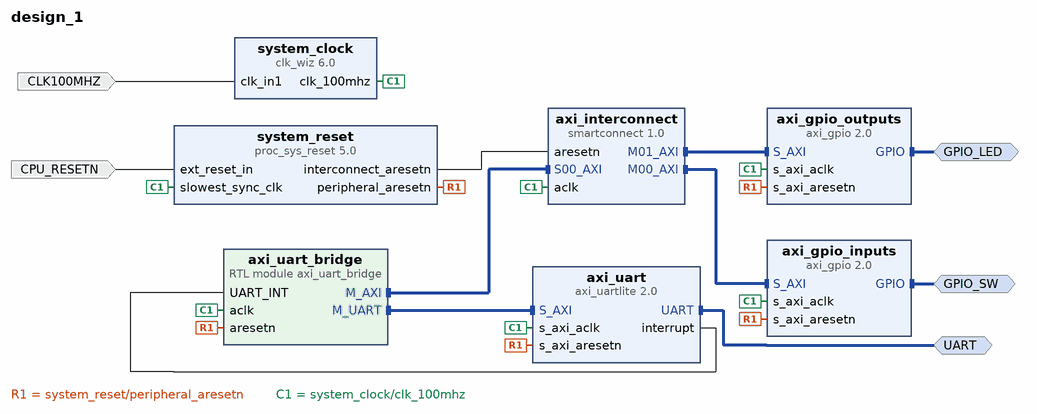
[diagram p0: block diagram of the top level]
# Vivado block design design_1, xc7a100tcsg324-1, Vivado 2021.1
create_bd_design design_1

create_bd_intf_port -mode Master -vlnv xilinx.com:interface:gpio_rtl:1.0 GPIO_LED
create_bd_intf_port -mode Master -vlnv xilinx.com:interface:gpio_rtl:1.0 GPIO_SW
create_bd_intf_port -mode Master -vlnv xilinx.com:interface:uart_rtl:1.0 UART
create_bd_port -dir I -type clk CLK100MHZ
set_property -dict {CONFIG.ASSOCIATED_RESET CPU_RESETN} [get_bd_ports CLK100MHZ]
create_bd_port -dir I -type rst CPU_RESETN

create_bd_cell -type ip -vlnv xilinx.com:ip:clk_wiz:6.0 system_clock
set_property -dict [list \
  CONFIG.CLKOUT1_DRIVES BUFGCE \
  CONFIG.CLKOUT2_DRIVES BUFGCE \
  CONFIG.CLKOUT3_DRIVES BUFGCE \
  CONFIG.CLKOUT4_DRIVES BUFGCE \
  CONFIG.CLKOUT5_DRIVES BUFGCE \
  CONFIG.CLKOUT6_DRIVES BUFGCE \
  CONFIG.CLKOUT7_DRIVES BUFGCE \
  CONFIG.CLK_OUT1_PORT clk_100mhz \
  CONFIG.FEEDBACK_SOURCE FDBK_AUTO \
  CONFIG.USE_LOCKED false \
  CONFIG.USE_RESET false \
  CONFIG.USE_SAFE_CLOCK_STARTUP true \
] [get_bd_cells system_clock]
create_bd_cell -type ip -vlnv xilinx.com:ip:proc_sys_reset:5.0 system_reset
set_property -dict {CONFIG.RESET_BOARD_INTERFACE reset CONFIG.USE_BOARD_FLOW true} [get_bd_cells system_reset]
create_bd_cell -type ip -vlnv xilinx.com:ip:smartconnect:1.0 axi_interconnect
set_property -dict {CONFIG.NUM_MI 2 CONFIG.NUM_SI 1} [get_bd_cells axi_interconnect]
create_bd_cell -type ip -vlnv xilinx.com:ip:axi_uartlite:2.0 axi_uart
set_property -dict [list \
  CONFIG.C_BAUDRATE 115200 \
  CONFIG.UARTLITE_BOARD_INTERFACE Custom \
  CONFIG.USE_BOARD_FLOW true \
] [get_bd_cells axi_uart]
create_bd_cell -type ip -vlnv xilinx.com:ip:axi_gpio:2.0 axi_gpio_inputs
set_property -dict [list \
  CONFIG.C_GPIO_WIDTH 4 \
  CONFIG.GPIO_BOARD_INTERFACE Custom \
  CONFIG.USE_BOARD_FLOW true \
] [get_bd_cells axi_gpio_inputs]
create_bd_cell -type ip -vlnv xilinx.com:ip:axi_gpio:2.0 axi_gpio_outputs
set_property -dict [list \
  CONFIG.C_ALL_INPUTS 0 \
  CONFIG.C_ALL_OUTPUTS 1 \
  CONFIG.C_GPIO_WIDTH 4 \
  CONFIG.GPIO_BOARD_INTERFACE Custom \
  CONFIG.USE_BOARD_FLOW true \
] [get_bd_cells axi_gpio_outputs]
create_bd_cell -type module -reference axi_uart_bridge axi_uart_bridge

# ---- connections ----

connect_bd_intf_net [get_bd_intf_ports GPIO_SW] [get_bd_intf_pins axi_gpio_inputs/GPIO]
connect_bd_intf_net [get_bd_intf_ports GPIO_LED] [get_bd_intf_pins axi_gpio_outputs/GPIO]
connect_bd_intf_net [get_bd_intf_pins axi_interconnect/M00_AXI] [get_bd_intf_pins axi_gpio_inputs/S_AXI]
connect_bd_intf_net [get_bd_intf_pins axi_gpio_outputs/S_AXI] [get_bd_intf_pins axi_interconnect/M01_AXI]
connect_bd_intf_net [get_bd_intf_ports UART] [get_bd_intf_pins axi_uart/UART]
connect_bd_intf_net -intf_net axi_uart_bridge_0_M_AXI [get_bd_intf_pins axi_uart_bridge/M_AXI] [get_bd_intf_pins axi_interconnect/S00_AXI]
connect_bd_intf_net -intf_net axi_uart_bridge_0_M_UART [get_bd_intf_pins axi_uart_bridge/M_UART] [get_bd_intf_pins axi_uart/S_AXI]
connect_bd_net [get_bd_pins axi_uart/interrupt] [get_bd_pins axi_uart_bridge/UART_INT]
connect_bd_net -net clk_in1_0_1 [get_bd_ports CLK100MHZ] [get_bd_pins system_clock/clk_in1]
connect_bd_net -net ext_reset_in_0_1 [get_bd_ports CPU_RESETN] [get_bd_pins system_reset/ext_reset_in]
connect_bd_net -net proc_sys_reset_0_peripheral_aresetn [get_bd_pins system_reset/peripheral_aresetn] \
  [get_bd_pins axi_uart/s_axi_aresetn] [get_bd_pins axi_gpio_inputs/s_axi_aresetn] \
  [get_bd_pins axi_gpio_outputs/s_axi_aresetn] [get_bd_pins axi_uart_bridge/aresetn]
connect_bd_net [get_bd_pins system_clock/clk_100mhz] \
  [get_bd_pins system_reset/slowest_sync_clk] [get_bd_pins axi_interconnect/aclk] [get_bd_pins axi_uart/s_axi_aclk] \
  [get_bd_pins axi_gpio_inputs/s_axi_aclk] [get_bd_pins axi_gpio_outputs/s_axi_aclk] [get_bd_pins axi_uart_bridge/aclk]
connect_bd_net [get_bd_pins system_reset/interconnect_aresetn] [get_bd_pins axi_interconnect/aresetn]

# ---- address map ----
assign_bd_address -offset 0x0000000040000000 -range 64K -target_address_space [get_bd_addr_spaces axi_uart_bridge/M_AXI] [get_bd_addr_segs axi_gpio_inputs/S_AXI/Reg]
assign_bd_address -offset 0x0000000040010000 -range 64K -target_address_space [get_bd_addr_spaces axi_uart_bridge/M_AXI] [get_bd_addr_segs axi_gpio_outputs/S_AXI/Reg]
assign_bd_address -offset 0x40600000 -range 64K -target_address_space [get_bd_addr_spaces axi_uart_bridge/M_UART] [get_bd_addr_segs axi_uart/S_AXI/Reg]

validate_bd_design
save_bd_design
